# Altium schematic sheet 2017-08-24_19-39-041.schdoc
size 370 x 127 mm; SheetNumber: 1; SheetTotal: 1
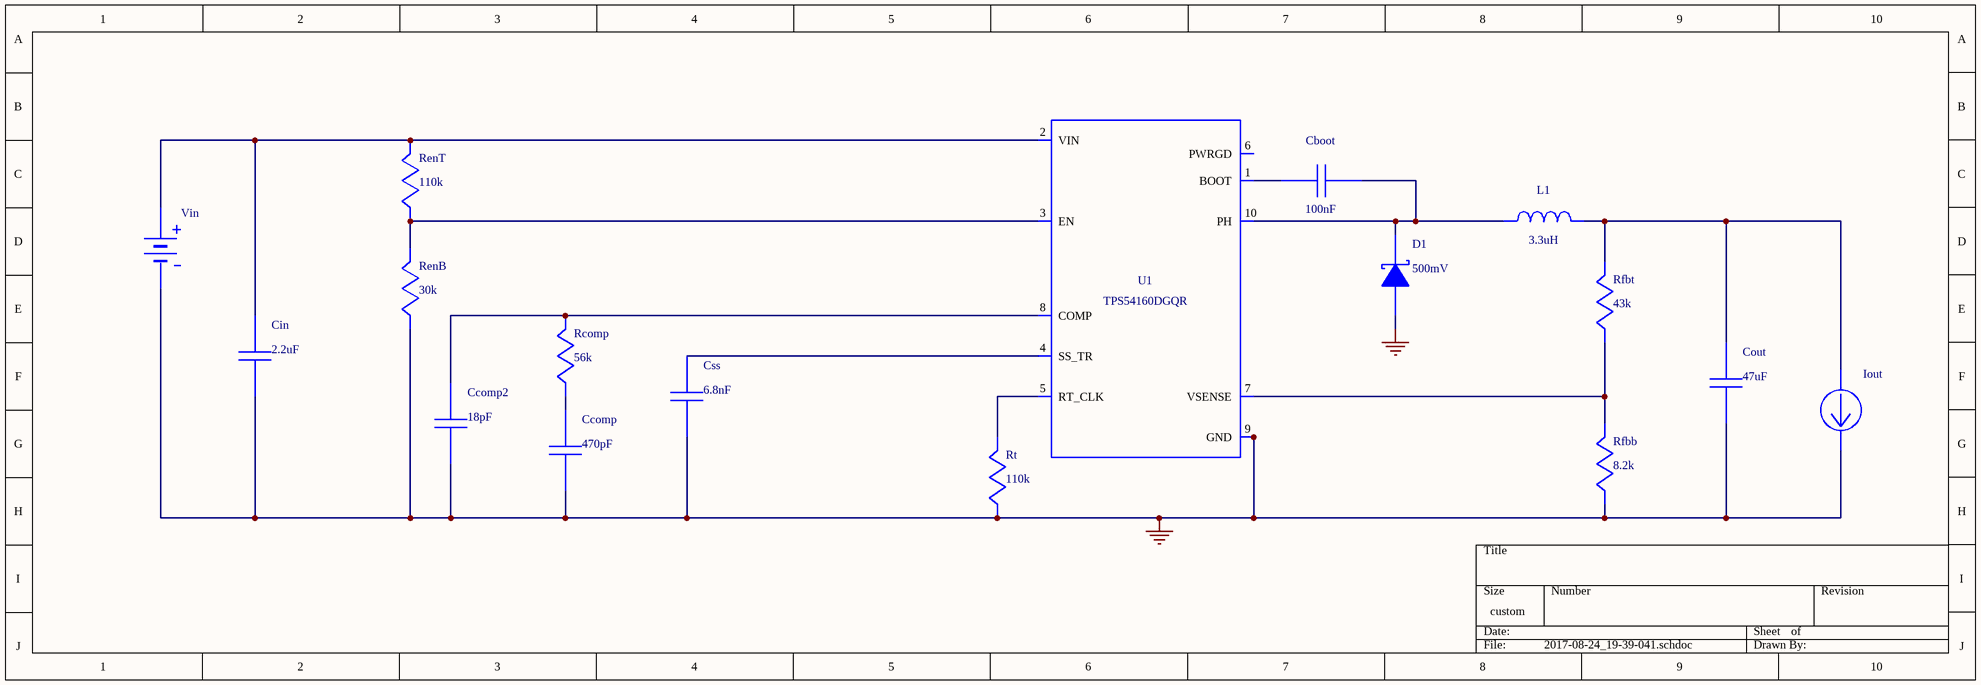
[diagram p0: 2017-08-24_19-39-041.schdoc]

## Parts
Cboot  value 100nF  (hidden comment: GRM155R61A104KA01D)
Ccomp  value 470pF  (hidden comment: CC0805KRX7R9BB471)
Ccomp2  value 18pF  [RAD-0.1]  (hidden comment: C0805C180K5GACTU)
Cin  value 2.2uF  (hidden comment: GRM188R61A225KE34D)
Cout  value 47uF  (hidden comment: C2012X5R1A476M125AC)
Css  value 6.8nF  (hidden comment: CC0805KRX7R9BB682)
D1  value 500mV  (hidden comment: B340A-13-F)
Iout  WB_CURRENT_LOAD  (value not drawn)
L1  value 3.3uH  (hidden comment: SRN6045-3R3Y)
Rcomp  value 56k  [AXIAL-0.4]  (hidden comment: RC1206FR-0756KL)
RenB  value 30k  [AXIAL-0.4]  (hidden comment: RC1206FR-0730KL)
RenT  value 110k  [AXIAL-0.4]  (hidden comment: ERJ-8ENF1103V)
Rfbb  value 8.2k  [AXIAL-0.4]  (hidden comment: RC1206FR-078K2L)
Rfbt  value 43k  [AXIAL-0.4]  (hidden comment: RC1206FR-0743KL)
Rt  value 110k  [AXIAL-0.4]  (hidden comment: CRCW1206110KFKEA)
U1  TPS54140DGQR  [N10A]  (value not drawn)
Vin  WB_BATTERY  (value not drawn)

## Nets
0: Ccomp.2 Ccomp2.2 Cin.2 Cout.2 Css.2 D1.2(A) Iout.2(-) RenB.2 Rfbb.2 Rt.2 U1.9(GND) U1.11(EPAD) Vin.2(-)
NetCboot_1: Cboot.1 U1.1(BOOT)
NetCboot_2: Cboot.2 D1.1(K) L1.2 U1.10(PH)
NetCcomp2_1: Ccomp2.1 Rcomp.1 U1.8(COMP)
NetCcomp_1: Ccomp.1 Rcomp.2
NetCin_1: Cin.1 RenT.1 U1.2(VIN) Vin.1(+)
NetCout_1: Cout.1 Iout.1(+) L1.1 Rfbt.1
NetCss_1: Css.1 U1.4(SS_TR)
NetRenB_1: RenB.1 RenT.2 U1.3(EN)
NetRfbb_1: Rfbb.1 Rfbt.2 U1.7(VSENSE)
NetRt_1: Rt.1 U1.5(RT_CLK)

Not connected (* = marked no-connect by the designer): U1 6(PWRGD)

## Library data of the parts
Cboot = GRM155R61A104KA01D: GRM155R61A104KA0; Manufacturer Name: MuRata; PackageReference: GRM155R61A104KA01D; Manufacturer Part Number: GRM155R61A104KA01D
Ccomp = CC0805KRX7R9BB471: CC0805KRX7R9BB47; Manufacturer Name: Yageo America; PackageReference: CC0805KRX7R9BB471; Manufacturer Part Number: CC0805KRX7R9BB471
Ccomp2 = C0805C180K5GACTU: Manufacturer Name: Kemet; PackageReference: C0805C180K5GACTU; Manufacturer Part Number: C0805C180K5GACTU
Cin = GRM188R61A225KE34D: GRM188R61A225KE3; Manufacturer Name: MuRata; PackageReference: GRM188R61A225KE34D; Manufacturer Part Number: GRM188R61A225KE34D
Cout = C2012X5R1A476M125AC: C2012X5R1A476M12; Manufacturer Name: TDK; PackageReference: C2012X5R1A476M125AC; Manufacturer Part Number: C2012X5R1A476M125AC
Css = CC0805KRX7R9BB682: CC0805KRX7R9BB68; Manufacturer Name: Yageo America; PackageReference: CC0805KRX7R9BB682; Manufacturer Part Number: CC0805KRX7R9BB682
D1 = B340A-13-F: Manufacturer Name: Diodes Inc.; PackageReference: B340A-13-F; Manufacturer Part Number: B340A-13-F
L1 = SRN6045-3R3Y: Manufacturer Name: Bourns; PackageReference: SRN6045-3R3Y; Manufacturer Part Number: SRN6045-3R3Y
Rcomp = RC1206FR-0756KL: Manufacturer Name: Yageo America; PackageReference: RC1206FR-0756KL; Manufacturer Part Number: RC1206FR-0756KL
RenB = RC1206FR-0730KL: Manufacturer Name: Yageo America; PackageReference: RC1206FR-0730KL; Manufacturer Part Number: RC1206FR-0730KL
RenT = ERJ-8ENF1103V: Manufacturer Name: Panasonic; PackageReference: ERJ-8ENF1103V; Manufacturer Part Number: ERJ-8ENF1103V
Rfbb = RC1206FR-078K2L: Manufacturer Name: Yageo America; PackageReference: RC1206FR-078K2L; Manufacturer Part Number: RC1206FR-078K2L
Rfbt = RC1206FR-0743KL: Manufacturer Name: Yageo America; PackageReference: RC1206FR-0743KL; Manufacturer Part Number: RC1206FR-0743KL
Rt = CRCW1206110KFKEA: Manufacturer Name: Vishay-Dale; PackageReference: CRCW1206110KFKEA; Manufacturer Part Number: CRCW1206110KFKEA
U1 = TPS54140DGQR: TPS54160DGQR; Manufacturer Name: Texas Instruments; PackageReference: TPS54160DGQR; Manufacturer Part Number: TPS54140DGQR; Value: N/A
Iout = WB_CURRENT_LOAD: PackageReference: WB_CURRENT_LOAD; Manufacturer Part Number: WB_CURRENT_LOAD; Manufacturer Name: WB_CURRENT_LOAD; Value: N/A
Vin = WB_BATTERY: PackageReference: WB_BATTERY; Manufacturer Part Number: WB_BATTERY; Manufacturer Name: WB_BATTERY; Value: N/A